# Altium schematic sheet 15_SOLEDNOID.SchDoc
size 420 x 297 mm; SheetNumber: 23; SheetTotal: 28
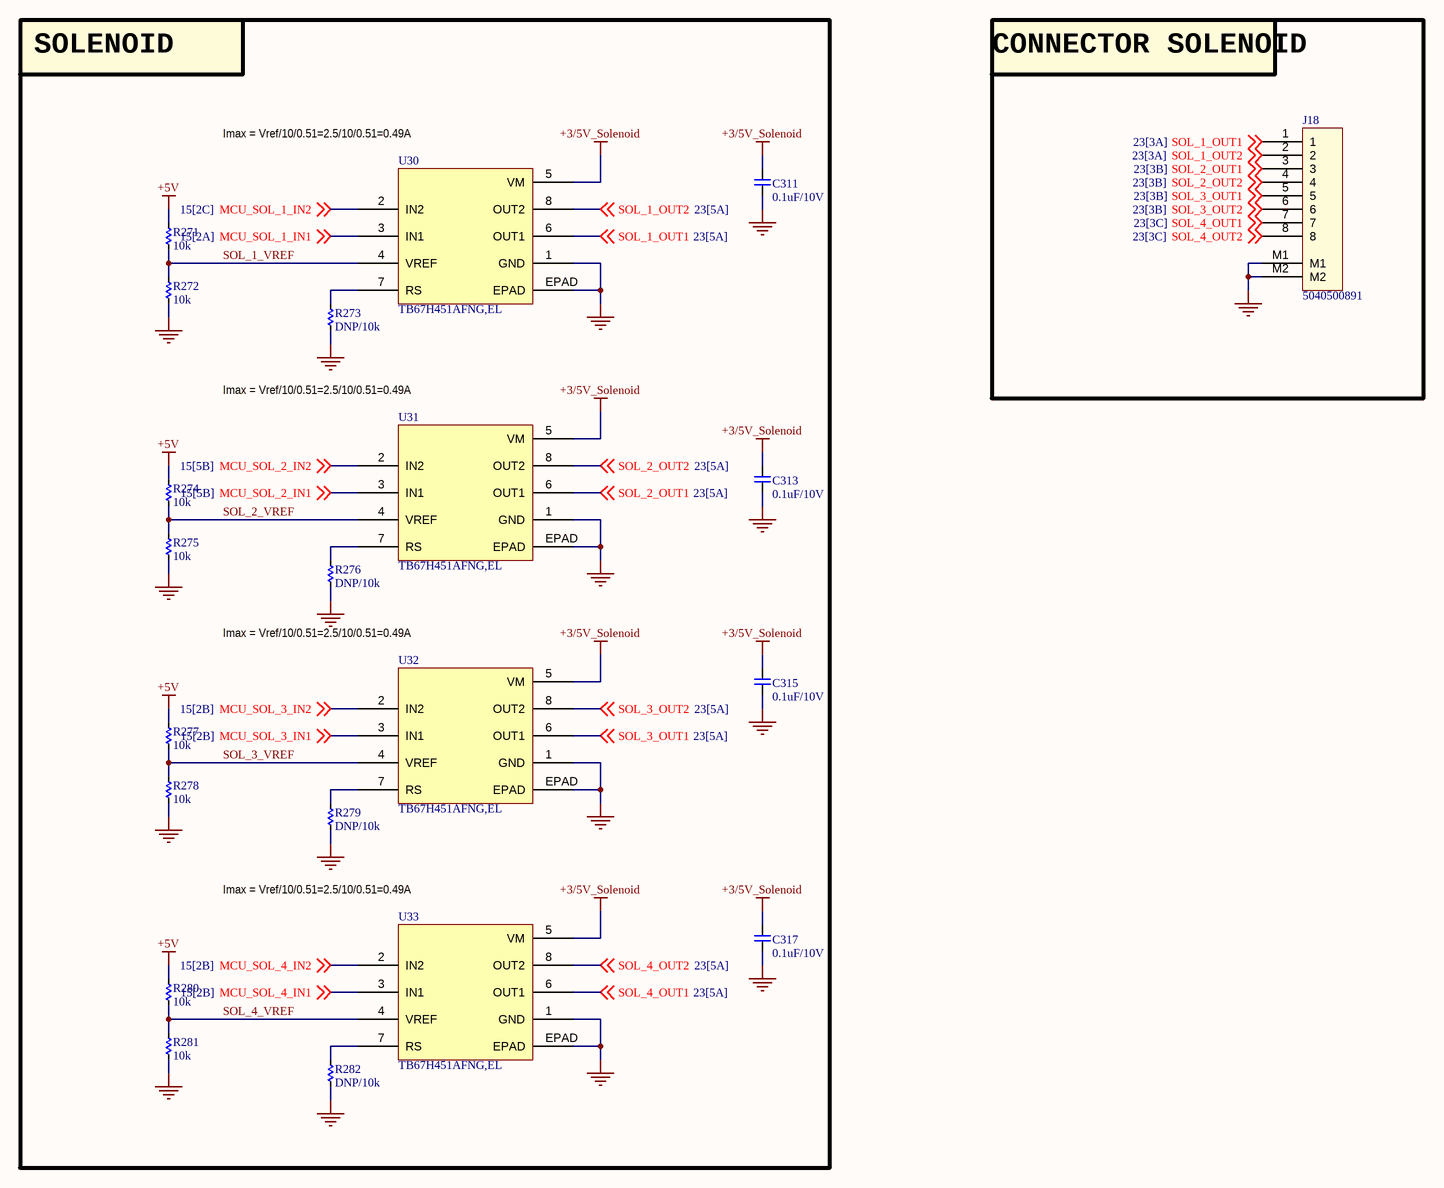
[diagram p0: 15_SOLEDNOID.SchDoc]

## Parts
C311  0.1uF/10V  [CAP_C_1005X60]
C313  0.1uF/10V  [CAP_C_1005X60]
C315  0.1uF/10V  [CAP_C_1005X60]
C317  0.1uF/10V  [CAP_C_1005X60]
J18  5040500891  [MOLEX_5040500891]
R271  10k  [RES_C_1005X40]
R272  10k  [RES_C_1005X40]
R273  DNP/10k  [RES_C_1005X40]
R274  10k  [RES_C_1005X40]
R275  10k  [RES_C_1005X40]
R276  DNP/10k  [RES_C_1005X40]
R277  10k  [RES_C_1005X40]
R278  10k  [RES_C_1005X40]
R279  DNP/10k  [RES_C_1005X40]
R280  10k  [RES_C_1005X40]
R281  10k  [RES_C_1005X40]
R282  DNP/10k  [RES_C_1005X40]
U30  TB67H451AFNG,EL  [SOIC127P602X173-8N_EPAD]
U31  TB67H451AFNG,EL  [SOIC127P602X173-8N_EPAD]
U32  TB67H451AFNG,EL  [SOIC127P602X173-8N_EPAD]
U33  TB67H451AFNG,EL  [SOIC127P602X173-8N_EPAD]

## Blocks framed on the sheet
SOLENOID: C311 C313 C315 C317 R271-R282 U30-U33
CONNECTOR SOLENOID: J18

## Nets
+3/5V_Solenoid: C311.2 C313.2 C315.2 C317.2 U30.5(VM) U31.5(VM) U32.5(VM) U33.5(VM)
+5V: R271.1 R274.1 R277.1 R280.1
GND: C311.1 C313.1 C315.1 C317.1 J18.M1 J18.M2 R272.2 R273.2 R275.2 R276.2 R278.2 R279.2 R281.2 R282.2 U30.1(GND) U30.EPAD U31.1(GND) U31.EPAD U32.1(GND) U32.EPAD U33.1(GND) U33.EPAD
MCU_SOL_1_IN1: U30.3(IN1) ; off-sheet MCU_SOL_1_IN1
MCU_SOL_1_IN2: U30.2(IN2) ; off-sheet MCU_SOL_1_IN2
MCU_SOL_2_IN1: U31.3(IN1) ; off-sheet MCU_SOL_2_IN1
MCU_SOL_2_IN2: U31.2(IN2) ; off-sheet MCU_SOL_2_IN2
MCU_SOL_3_IN1: U32.3(IN1) ; off-sheet MCU_SOL_3_IN1
MCU_SOL_3_IN2: U32.2(IN2) ; off-sheet MCU_SOL_3_IN2
MCU_SOL_4_IN1: U33.3(IN1) ; off-sheet MCU_SOL_4_IN1
MCU_SOL_4_IN2: U33.2(IN2) ; off-sheet MCU_SOL_4_IN2
SOL_1_OUT1: J18.1 U30.6(OUT1) ; off-sheet SOL_1_OUT1
SOL_1_OUT2: J18.2 U30.8(OUT2) ; off-sheet SOL_1_OUT2
SOL_1_VREF: R271.2 R272.1 U30.4(VREF)
SOL_2_OUT1: J18.3 U31.6(OUT1) ; off-sheet SOL_2_OUT1
SOL_2_OUT2: J18.4 U31.8(OUT2) ; off-sheet SOL_2_OUT2
SOL_2_VREF: R274.2 R275.1 U31.4(VREF)
SOL_3_OUT1: J18.5 U32.6(OUT1) ; off-sheet SOL_3_OUT1
SOL_3_OUT2: J18.6 U32.8(OUT2) ; off-sheet SOL_3_OUT2
SOL_3_VREF: R277.2 R278.1 U32.4(VREF)
SOL_4_OUT1: J18.7 U33.6(OUT1) ; off-sheet SOL_4_OUT1
SOL_4_OUT2: J18.8 U33.8(OUT2) ; off-sheet SOL_4_OUT2
SOL_4_VREF: R280.2 R281.1 U33.4(VREF)
NetR273_1: R273.1 U30.7(RS)
NetR276_1: R276.1 U31.7(RS)
NetR279_1: R279.1 U32.7(RS)
NetR282_1: R282.1 U33.7(RS)

## Notes on the sheet
- (near U30) Imax = Vref/10/0.51=2.5/10/0.51=0.49A
- Imax = Vref/10/0.51=2.5/10/0.51=0.49A
- Project:
- Sub-system:
- Design by:
- Sheet title:
- Sheet
- of
- Checked by:
- Approved by:
- Revision:
- Document No:
- Size:
- Date:
- A3

## Library data of the parts
C311 C313 C315 C317 = _CAP_C_2: CAP CHIP
J18 = Header 8x1_2M
R271-R282 = _RES_B_2: RES
U30-U33 = IC_H_bridge_TB67H451AFNG,EL: BRUSHED MOTOR DRIVER IC, 50V, 3.